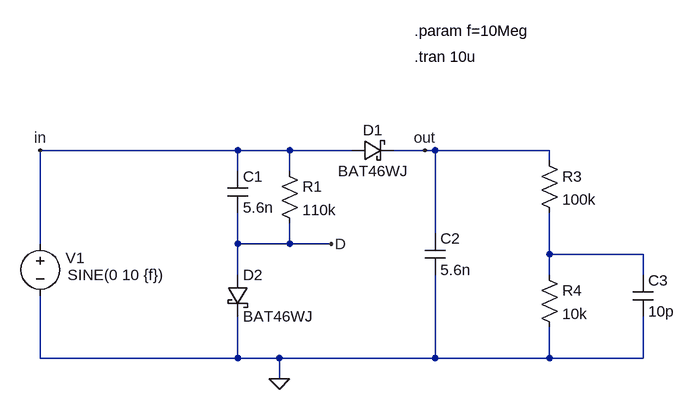
[diagram p0: schematic peak_detector_diode_comp_ver2.asc]
peak_detector_diode_comp_ver2.asc, the LTspice schematic file:
Version 4
SHEET 1 1120 680
WIRE 96 48 -208 48
WIRE 176 48 96 48
WIRE 272 48 176 48
WIRE 384 48 336 48
WIRE 400 48 384 48
WIRE 576 48 400 48
WIRE 576 64 576 48
WIRE 96 80 96 48
WIRE 176 80 176 48
WIRE 400 176 400 48
WIRE -208 192 -208 48
WIRE 96 192 96 144
WIRE 176 192 176 160
WIRE 176 192 96 192
WIRE 240 192 176 192
WIRE 576 208 576 144
WIRE 720 208 576 208
WIRE 96 240 96 192
WIRE 576 240 576 208
WIRE 720 240 720 208
WIRE -208 368 -208 272
WIRE 96 368 96 304
WIRE 96 368 -208 368
WIRE 160 368 96 368
WIRE 400 368 400 240
WIRE 400 368 160 368
WIRE 576 368 576 320
WIRE 576 368 400 368
WIRE 720 368 720 304
WIRE 720 368 576 368
WIRE 160 400 160 368
FLAG 384 48 out
FLAG -208 48 in
FLAG 160 400 0
FLAG 240 192 D
SYMBOL schottky 272 64 R270
WINDOW 0 32 32 VTop 2
WINDOW 3 0 32 VBottom 2
SYMATTR InstName D1
SYMATTR Value BAT46WJ
SYMATTR Description Diode
SYMATTR Type diode
SYMBOL voltage -208 176 R0
WINDOW 3 42 64 Left 2
WINDOW 123 24 124 Left 2
WINDOW 39 0 0 Left 0
WINDOW 0 39 38 Left 2
SYMATTR Value SINE(0 10 {f})
SYMATTR InstName V1
SYMBOL cap 384 176 R0
SYMATTR InstName C2
SYMATTR Value 5.6n
SYMBOL res 560 48 R0
SYMATTR InstName R3
SYMATTR Value 100k
SYMBOL res 560 224 R0
SYMATTR InstName R4
SYMATTR Value 10k
SYMBOL cap 704 240 R0
SYMATTR InstName C3
SYMATTR Value 10p
SYMBOL schottky 80 240 R0
SYMATTR InstName D2
SYMATTR Value BAT46WJ
SYMATTR Description Diode
SYMATTR Type diode
SYMBOL cap 80 80 R0
SYMATTR InstName C1
SYMATTR Value 5.6n
SYMBOL res 160 64 R0
SYMATTR InstName R1
SYMATTR Value 110k
TEXT 368 -136 Left 2 !.param f=10Meg
TEXT 368 -96 Left 2 !.tran 10u

The netlist it stands for:
* peak_detector_diode_comp_ver2.asc
D1 in out BAT46WJ
V1 in 0 SINE(0 10 {f})
C2 out 0 5.6n
R3 out N001 100k
R4 N001 0 10k
C3 N001 0 10p
D2 D 0 BAT46WJ
C1 in D 5.6n
R1 in D 110k
.model D D
.lib standard.dio
.param f=10Meg
.tran 10u
.backanno
.end